# EAGLE schematic ts10 (EAGLE 9.6.0)
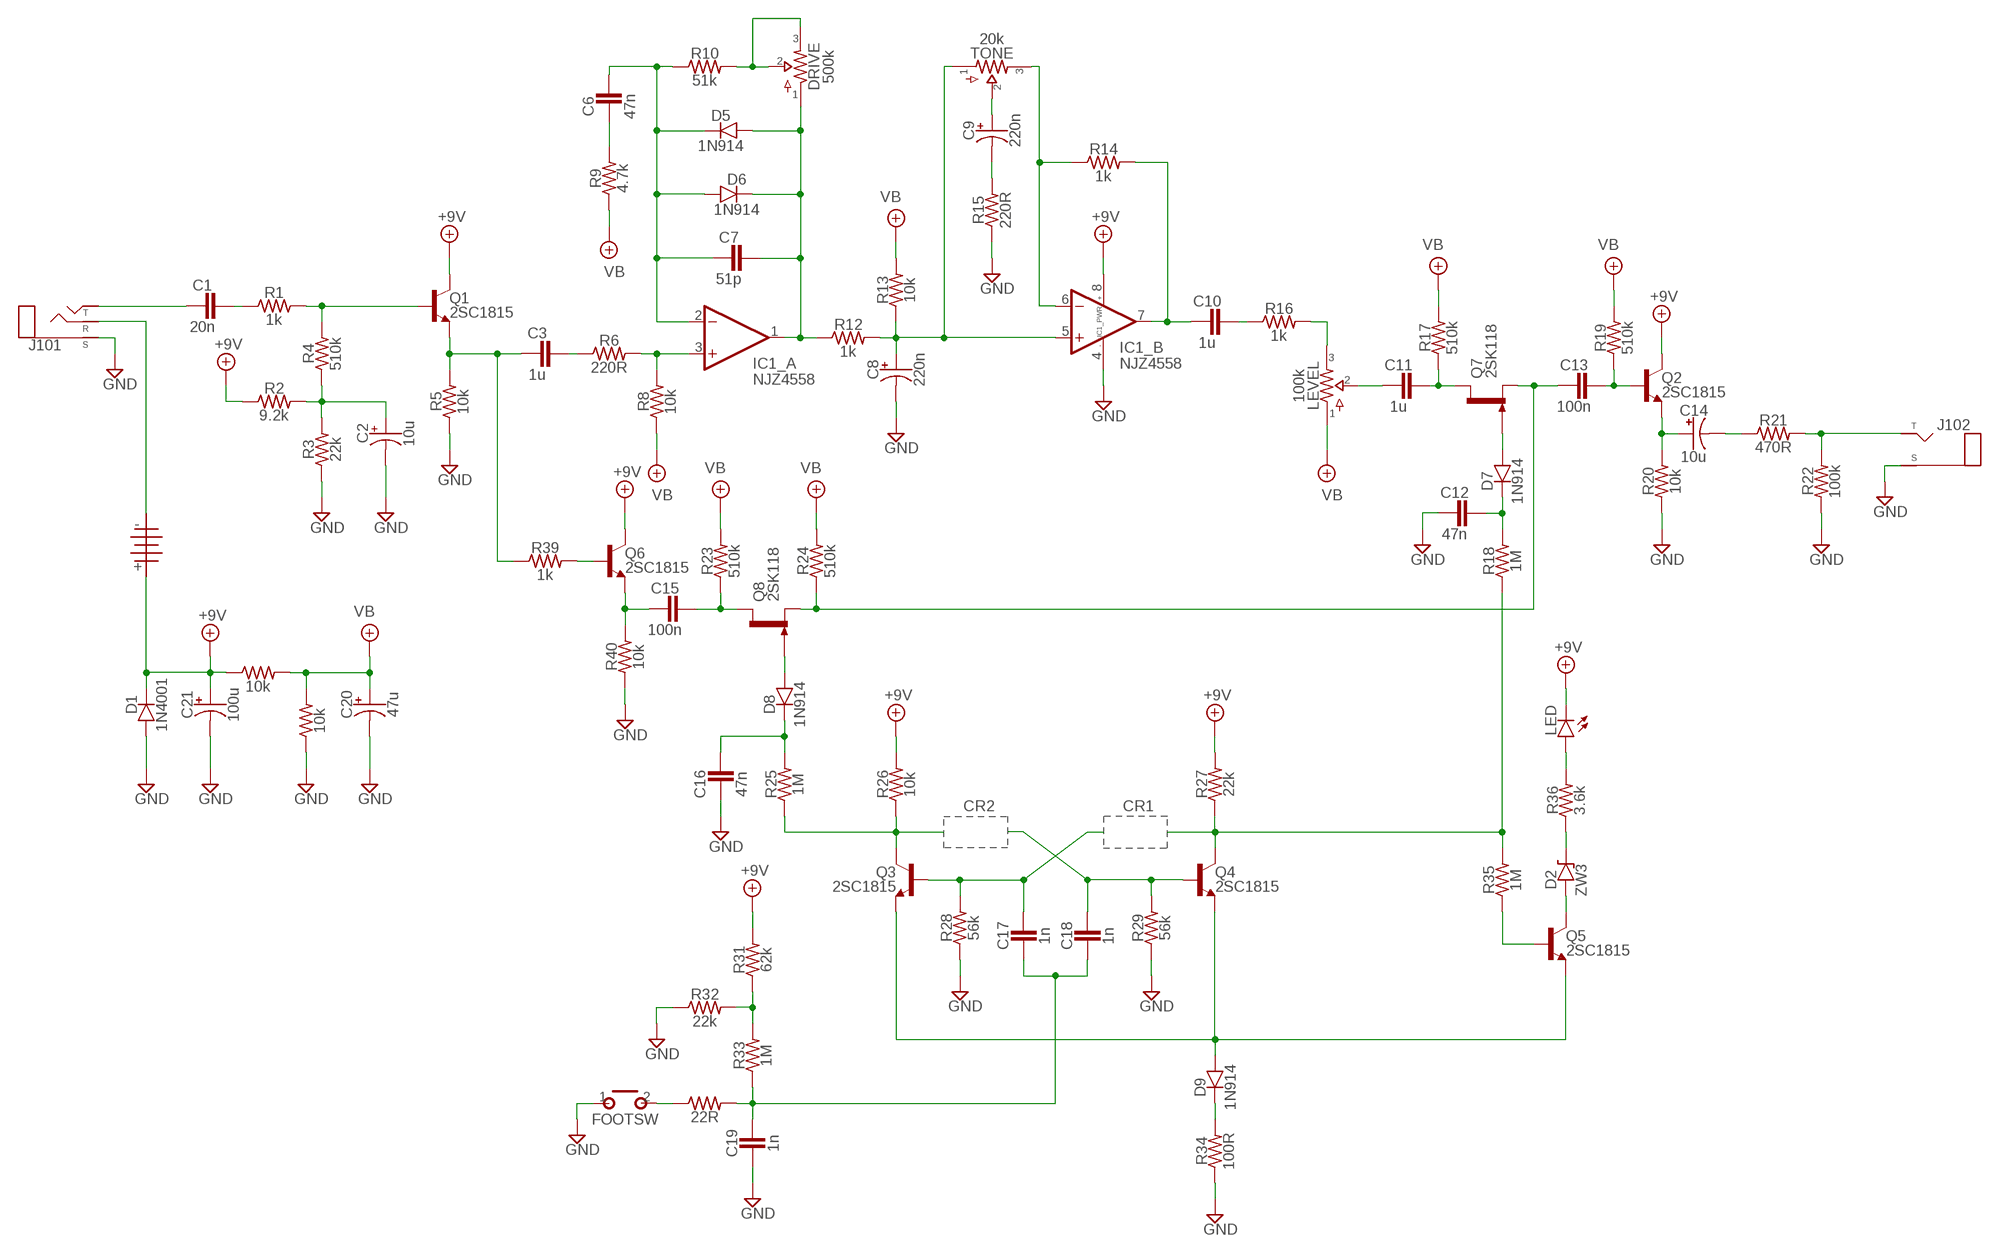
[diagram p0: schematic, sheet 1]

## Parts
1101  BATTERY  [TWO_PADS]
C1  20n  CER/FILMBOX.1  [BOX_SMALL]
C2  10u  0500  [050_020]
C3  1u  CER/FILMBOX.1  [BOX_SMALL]
C6  47n  CER/FILMBOX.1  [BOX_SMALL]
C7  51p  CER/FILMBOX.1  [BOX_SMALL]
C8  220n  0500  [050_020]
C9  220n  0500  [050_020]
C10  1u  CER/FILMBOX.1  [BOX_SMALL]
C11  1u  CER/FILMBOX.1  [BOX_SMALL]
C12  47n  CER/FILMBOX.1  [BOX_SMALL]
C13  100n  CER/FILMBOX.1  [BOX_SMALL]
C14  10u  0500  [050_020]
C15  100n  CER/FILMBOX.1  [BOX_SMALL]
C16  47n  CER/FILMBOX.1  [BOX_SMALL]
C17  1n  CER/FILMBOX.1  [BOX_SMALL]
C18  1n  CER/FILMBOX.1  [BOX_SMALL]
C19  1n  CER/FILMBOX.1  [BOX_SMALL]
C20  47u  0500  [050_020]
C21  100u  0500  [050_020]
D1  1N4001  DO35.2  [DO35-2]
D2  ZW3  ZENER.3  [DO41-3]
D5  1N914  DO35.2  [DO35-2]
D6  1N914  DO35.2  [DO35-2]
D7  1N914  DO35.2  [DO35-2]
D8  1N914  DO35.2  [DO35-2]
D9  1N914  DO35.2  [DO35-2]
DRIVE  500k  POTS16MM  [16MM]
FOOTSW  MOMENTARY  [SPST]
IC1  NJZ4558  DUALTH  [DIL0]
J101  STEREO  [STEREO_PCB]
J102  MONO  [TWO_PADS]
LED  LED  [3MM_D]
LEVEL  100k  POTS16MM  [16MM]
Q1  2SC1815  2N3904  [TO92-]
Q2  2SC1815  2N3904  [TO92-]
Q3  2SC1815  2SC828A  [TO92-]
Q4  2SC1815  2SC828A  [TO92-]
Q5  2SC1815  2SC828A  [TO92-]
Q6  2SC1815  2N3904  [TO92-]
Q7  2SK118  2SK170  [TO92-]
Q8  2SK118  2SK170  [TO92-]
R1  1k  R_.3B  [R0207/3]
R2  9.2k  R_.3B  [R0207/3]
R3  22k  R_.3B  [R0207/3]
R4  510k  R_.3B  [R0207/3]
R5  10k  R_.3B  [R0207/3]
R6  220R  R_.3B  [R0207/3]
R8  10k  R_.3B  [R0207/3]
R9  4.7k  R_.3B  [R0207/3]
R10  51k  R_.3B  [R0207/3]
R12  1k  R_.3B  [R0207/3]
R13  10k  R_.3B  [R0207/3]
R14  1k  R_.3B  [R0207/3]
R15  220R  R_.3B  [R0207/3]
R16  1k  R_.3B  [R0207/3]
R17  510k  R_.3B  [R0207/3]
R18  1M  R_.3B  [R0207/3]
R19  510k  R_.3B  [R0207/3]
R20  10k  R_.3B  [R0207/3]
R21  470R  R_.3B  [R0207/3]
R22  100k  R_.3B  [R0207/3]
R23  510k  R_.3B  [R0207/3]
R24  510k  R_.3B  [R0207/3]
R25  1M  R_.3B  [R0207/3]
R26  10k  R_.3B  [R0207/3]
R27  22k  R_.3B  [R0207/3]
R28  56k  R_.3B  [R0207/3]
R29  56k  R_.3B  [R0207/3]
R31  62k  R_.3B  [R0207/3]
R32  22k  R_.3B  [R0207/3]
R33  1M  R_.3B  [R0207/3]
R34  100R  R_.3B  [R0207/3]
R35  1M  R_.3B  [R0207/3]
R36  3.6k  R_.3B  [R0207/3]
R39  1k  R_.3B  [R0207/3]
R40  10k  R_.3B  [R0207/3]
R101  10k  R_.3B  [R0207/3]
R104  10k  R_.3B  [R0207/3]
TONE  20k  POTS16MM  [16MM]
   22R  R_.3B  [R0207/3]

## Nets
+9V: 1101.T C21.+ D1.C IC1.8(_PWR:V+) LED.P$1(C) Q1.1(C) Q2.1(C) Q6.1(C) R2.1 R26.2 R27.2 R31.2 R101.1
GND: C2.- C8.- C12.2 C16.2 C19.2 C20.- C21.- D1.A FOOTSW.1(P) IC1.4(_PWR:V-) J101.P$1(S) J102.S(SLEEVE) R3.1 R5.1 R15.1 R20.1 R22.1 R28.1 R29.1 R32.1 R34.1 R40.1 R104.1
N$1: C1.2 J101.P$3(T)
N$2: C1.1 R1.1
N$3: Q1.2(B) R1.2 R4.2
N$4: C3.2 Q1.3(E) R5.2 R39.1
N$5: C11.1 Q7.3(D) R17.1
N$6: C2.+ R2.2 R3.2 R4.1
N$7: C9.- R15.2
N$8: C3.1 R6.1
N$9: IC1.3(_A:+IN) R6.2 R8.2
N$10: D9.A Q3.3(E) Q4.3(E) Q5.3(E)
N$11: C6.1 C7.2 D5.C D6.A IC1.2(_A:-IN) R10.1
N$12: C7.1 D5.A D6.C DRIVE.1 IC1.1(_A:OUT) R12.1
N$13: DRIVE.2 DRIVE.3 R10.2
N$14: C8.+ IC1.5(_B:+IN) R12.2 R13.1 TONE.1
N$15: C6.2 R9.2
N$16: D7.A Q7.2(G)
N$17: Q6.2(B) R39.2
N$18: C12.1 D7.C R18.2
N$19: IC1.6(_B:-IN) R14.1 TONE.3
N$20: C10.2 IC1.7(_B:OUT) R14.2
N$21: C15.2 Q6.3(E) R40.2
N$22: Q5.1(B) R35.1
N$23: C15.1 Q8.3(D) R23.1
N$24: LED.ANODE(A) R36.2
N$25: D2.C R36.1
N$26: C13.2 Q7.1(S) Q8.1(S) R24.1
N$27: C10.1 R16.1
N$28: LEVEL.3 R16.2
N$29: Q3.2(C) R25.1 R26.1
N$30: C11.2 LEVEL.2
N$31: Q4.2(C) R18.1 R27.1 R35.2
N$32: C17.1 Q3.1(B) R28.2
N$33: C13.1 Q2.2(B) R19.1
N$34: C18.1 Q4.1(B) R29.2
N$35: C14.+ Q2.3(E) R20.2
N$36: C14.- R21.1
N$37: J102.T(TIP) R21.2 R22.2
N$38: 1101.S J101.P$2(R)
N$39: D2.A Q5.2(C)
N$40: D9.C R34.2
N$41: D8.A Q8.2(G)
N$42: C16.1 D8.C R25.2
N$43: C9.+ TONE.2
N$44: FOOTSW.2(S)  .1
N$45: R31.1 R32.2 R33.2
N$46: C17.2 C18.2 C19.1 R33.1  .2
VB: C20.+ LEVEL.1 R8.1 R9.1 R13.2 R17.2 R19.2 R23.2 R24.2 R101.2 R104.2

## Notes on the sheet
- CR2 | CR1

## Library data of the parts
1101 = pedals-jacks:BATTERY
C1 C3 C6 C7 C10-C13 C15-C19 = pedals-capacitors-film:CER/FILM: 47 - 120pF Xicon Ceramic Disc 2.5mm lead spacing
C2 C8 C9 C14 C20 C21 = pedals-capacitors-elec:050
D1 D5-D9 = pedals-diodes:DO35: DO-35 Package Diodes: 1N914
D2 = pedals-diodes:ZENER
DRIVE LEVEL TONE = pedals-potentiometers:POTS
FOOTSW = pedals-switches:MOMENTARY
IC1 = pedals-integrated circuits:DUAL: OP AMP
J101 = pedals-jacks:STEREO
J102 = pedals-jacks:MONO: Mono 1/4" Phone Jack
LED = pedals-diodes:LED
Q1 Q2 Q6 = pedals-transistors:2N3904: NPN Transistor
Q3-Q5 = pedals-transistors:2SC828A
Q7 Q8 = pedals-transistors:2SK170
R1-R6 R8-R10 R12-R29 R31-R36 R39 R40 R101 R104   = pedals-resistors:R_